# Altium schematic sheet Controller-Sheet.SchDoc
size A; DocumentNumber: 3; SheetNumber: 3; SheetTotal: 5
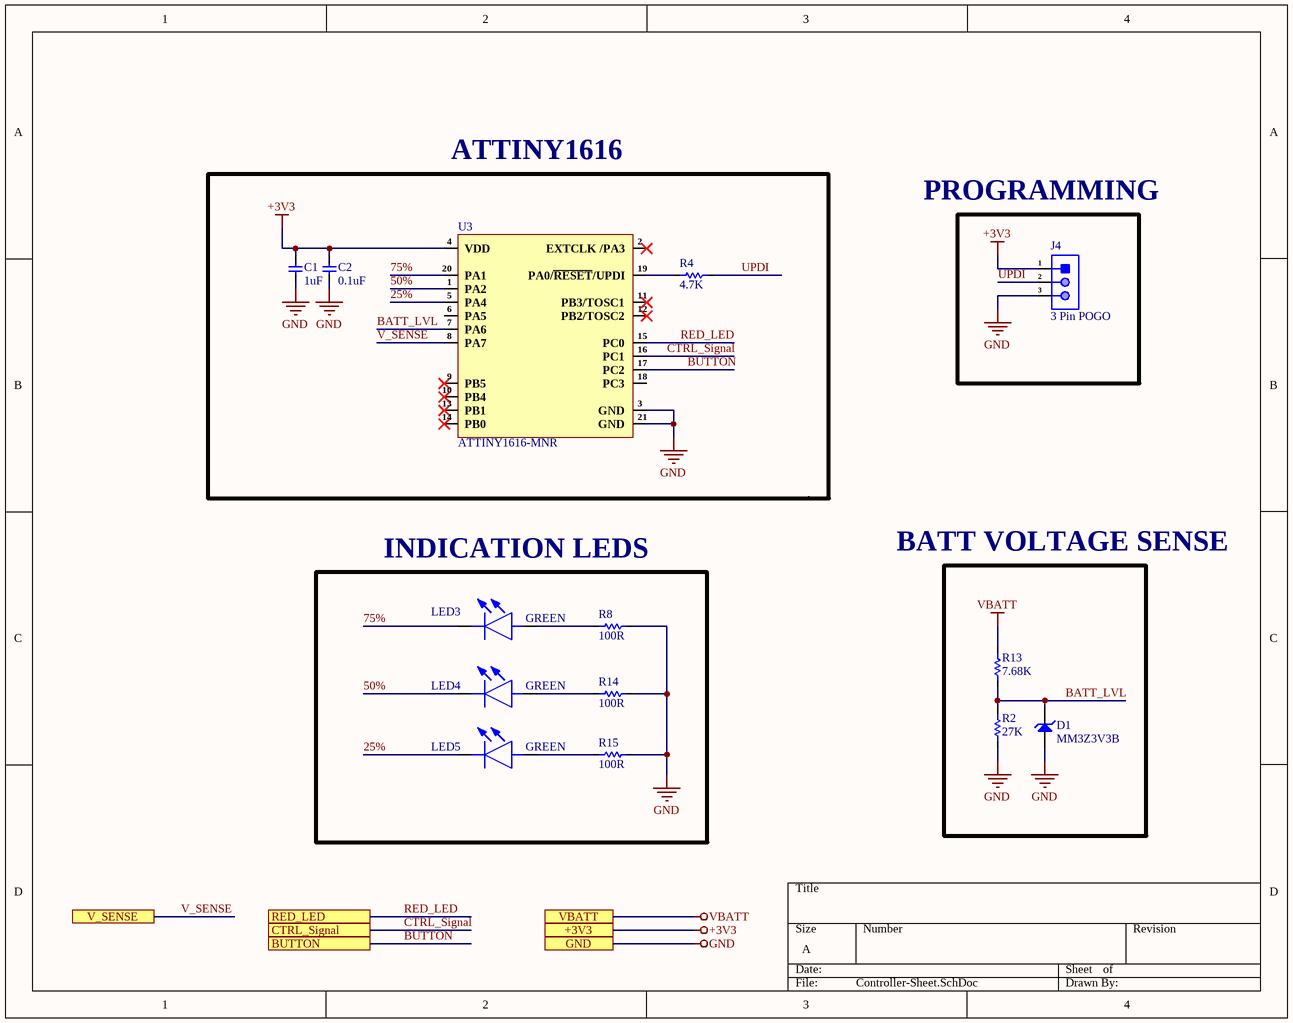
[diagram p0: Controller-Sheet.SchDoc]

## Parts
C1  1uF  [Cap-0402]
C2  0.1uF  [Cap-0402]
D1  MM3Z3V3B  [SOD323F]
J4  3 Pin POGO  [3 Pin POGO]
LED3  GREEN  [150060GS75000]
LED4  GREEN  [150060GS75000]
LED5  GREEN  [150060GS75000]
R2  27K  [Res-0402]
R4  4.7K  [Res-0402]
R8  100R  [Res-0402]
R13  7.68K  [Res-0402]
R14  100R  [Res-0402]
R15  100R  [Res-0402]
U3  ATTINY1616-MNR  [20-VQFN (3x3)]

## Blocks framed on the sheet
INDICATION LEDS: LED3-LED5 R8 R14 R15

## Ports
+3V3 (see Top-Sheet[3A], Connector-Sheet[2D], LED-Driver-Sheet[2D], Power-Sheet[2D]), BUTTON (see Top-Sheet[3B], LED-Driver-Sheet[1D]), CTRL_Signal (see Top-Sheet[3B], LED-Driver-Sheet[1D]), GND (see Top-Sheet[3A], Connector-Sheet[2D], LED-Driver-Sheet[2D], Power-Sheet[2D]), RED_LED (see Top-Sheet[3B], LED-Driver-Sheet[1D]), V_SENSE (see Top-Sheet[3B], Power-Sheet[1D]), VBATT (see Top-Sheet[3A], Connector-Sheet[2D], LED-Driver-Sheet[2D], Power-Sheet[2D])

## Nets
+3V3: C1.2 C2.2 J4.1 U3.4(VDD) ; port +3V3
GND: C1.1 C2.1 D1.1(A) J4.3 R2.1 R8.2 R14.2 R15.2 U3.3(GND) U3.21(GND) ; port GND
VBATT: R13.2 ; port VBATT
25%: LED5.1 U3.5(PA4)
50%: LED4.1 U3.1(PA2)
75%: LED3.1 U3.20(PA1)
BATT_LVL: D1.2(K) R2.2 R13.1 U3.7(PA6)
BUTTON: U3.17(PC2) ; port BUTTON
CTRL_Signal: U3.16(PC1) ; port CTRL_Signal
RED_LED: U3.15(PC0) ; port RED_LED
UPDI: J4.2 R4.2
V_SENSE: U3.8(PA7) ; port V_SENSE
NetLED3_2: LED3.2 R8.1
NetLED4_2: LED4.2 R14.1
NetLED5_2: LED5.2 R15.1
NetR4_1: R4.1 U3.19(PA0/~{RESET}/UPDI)

Not connected (* = marked no-connect by the designer): U3 2(EXTCLK_/PA3)* 6(PA5) 9(PB5)* 10(PB4)* 11(PB3/TOSC1)* 12(PB2/TOSC2)* 13(PB1)* 14(PB0)* 18(PC3)

## Notes on the sheet
- ATTINY1616
- PROGRAMMING
- BATT VOLTAGE SENSE

## Library data of the parts
C1 = GRM033R60J105MEA2D: 1 µF ±20% 6.3V Ceramic Capacitor X5R 0201 (0603 Metric); Manufacturer: Murata Electronics; Manufacturer Part Number: GRM033R60J105MEA2D; Digikey Part Number: 490-7229-6-ND; Item Type: Capacitor; Package: 0201; ComponentLink1Description: Digikey Link; ComponentLink1URL: https://www.digikey.com/en/products/detail/murata-electronics/GRM033R60J105MEA2D/4213369
C2 = GRM155R71C104KA88J: 0.1 µF ±10% 16V Ceramic Capacitor X7R 0402 (1005 Metric); Manufacturer: Murata Electronics; Manufacturer Part Number: GRM155R71C104KA88J; Digikey Part Number: 490-6328-6-ND; Item Type: Capacitor; Package: 0402; ComponentLink1Description: Digikey Link; ComponentLink1URL: https://www.digikey.com/en/products/detail/murata-electronics/GRM155R71C104KA88J/2610892
D1 = MM3Z3V3B: DIODE ZENER 3.3V 200MW SOD323F; Manufacturer: ON Semiconductor / Fairchild; Forward Voltage: 1V; Tolerance: 2%; Impedance: 89R; Max Reverse Leakage Current: 4.5uA; Test Current: 5mA; Element Configuration: Single; Supplier 1: Digi-Key; Manufacturer Part Number: MM3Z3V3B; Stock 1: 473644; Pricing 1: 1=0.22, 10=0.18, 100=0.0956, 500=0.06288, 1000=0.04276 (USD); Mount: Surface Mount; Number of Pins: 2; Weight: 0.0276g; Min Operating Temperature: -65°C; Max Operating Temperature: 150°C; Packaging: Tape and Reel; Package Quantity: 1; Max Power Dissipation: 200mW; Zener Voltage: 3.3V; Voltage Tolerance: 2%; Power Dissipation: 200mW; Working Voltage: 3.3V; Peak Reverse Current: 4.5uA; Length: 1.3mm; Height: 1mm; Width: 1.7mm; Radiation Hardening: No; REACH SVHC: No SVHC; Lead Free: Lead Free; ComponentLink1URL: http://www.onsemi.com/pub/Collateral/MM3Z9V1B-D.pdf?src-supplier=Digi-Key; ComponentLink1Description: http://www.onsemi.com/pub/Collateral/MM3Z9V1B-D.pdf?src-supplier=Digi-Key; ComponentLink2URL: http://www.mouser.com/ds/2/149/MM3Z3V3B-187166.pdf?src-supplier=Mouser; ComponentLink2Description: http://www.mouser.com/ds/2/149/MM3Z3V3B-187166.pdf?src-supplier=Mouser; ComponentLink3URL: https://www.fairchildsemi.com/datasheets/MM/MM3Z9V1B.pdf?src-supplier=Avnet; ComponentLink3Description: https://www.fairchildsemi.com/datasheets/MM/MM3Z9V1B.pdf?src-supplier=Avnet; ComponentLink4URL: http://www.farnell.com/datasheets/1706525.pdf?src-supplier=Element14; ComponentLink4Description: http://www.farnell.com/datasheets/1706525.pdf?src-supplier=Element14; Supplier Part Number 1: MM3Z3V3BCT-ND; Digikey Part Number: MM3Z3V3BDKR-ND; Item Type: Diode; ComponentLink5Description: Digikey Link; ComponentLink5URL: https://www.digikey.com/en/products/detail/onsemi/MM3Z3V3B/1626765?s=N4IgTCBcDaILJwMwC1EDVECEQF0C%2BQA
J4 = 68000-103HLF: CONN HEADER VERT 3POS 2.54MM; Item Type: Male Header; Number of Positions: 3; Current Rating: 3A; Insulation Resistance: 5GR; Voltage Rating: 1.5kV; Contact Post Length: 2.41mm; LCSC Part Number: C168677; ComponentLink1Description: LCSC; Supplier: Avnet; Supplier Part Number: 88K1775; RoHS: No; Category: Headers and Wire Housings; Stock: 2805; Pricing: 1=0.395, 10=0.31, 25=0.29, 50=0.27, 100=0.25 (USD); Contact Plating: Gold,GXT; Contact Material: Bronze; Housing Material: Thermoplastic; Housing Color: Black; Min Operating Temperature: -65°C; Max Operating Temperature: 125°C; Number of Rows: 1; Termination: Through Hole; Packaging: Bulk; Number of Contacts: 3; Contact Gender: Male; Orientation: Straight; Max Voltage Rating (AC): 1.5kV; Package Quantity: 100; Series: 68000; Length: 7.62mm; Pitch: 2.54mm; Contact Mating Length: 5.84mm; Depth: 2.41mm; Radiation Hardening: No; Flammability Rating: UL94 V-0; Reach SVHC Compliant: No; ComponentLink2URL: https://datasheet.ciiva.com/46392/1914865-46392021.pdf?src-supplier=Element14; ComponentLink2Description: https://datasheet.ciiva.com/46392/1914865-46392021.pdf?src-supplier=Element14; Digikey Part Number: 609-3461-ND; ComponentLink3Description: Digikey Link; ComponentLink3URL: https://www.digikey.com/en/products/detail/amphenol-cs-fci/68000-103HLF/2023309?s=N4IgTCBcDaIGwA4AMKC0BGJBmAEgGQDEQBdAXyA; Manufacturer Part Number: 68000-103HLF
LED3-LED5 = 150060GS75000: Green 520nm LED Indication - Discrete 3.2V 0603 (1608 Metric); Manufacturer: Würth Elektronik; Manufacturer Part Number: 150060GS75000; Supplier Part Number: 732-4971-6-ND; Item Type: LED; ComponentLink1Description: Digikey Link; ComponentLink1URL: https://www.digikey.com/en/products/detail/w%C3%BCrth-elektronik/150060GS75000/4489898; Package: 0603; Digikey Part Number: 732-4971-6-ND
R2 = RC0402FR-0727KL: 27 kOhms ±1% 0.063W, 1/16W Chip Resistor 0402 (1005 Metric) Moisture Resistant Thick Film; Manufacturer: YAGEO; Manufacturer Part Number: RC0402FR-0727KL; ComponentLink1Description: New link; ComponentLink1URL: *; Digikey Part Number: 311-27.0KLRDKR-ND; Item Type: Resistor; Package: 0402
R4 = RC0402FR-074K7L: 4.7 kOhms ±1% 0.063W, 1/16W Chip Resistor 0402 (1005 Metric) Moisture Resistant Thick Film; Manufacturer: YAGEO; Manufacturer Part Number: RC0402FR-074K7L; Digikey Part Number: 311-4.7KLRDKR-ND; Item Type: Resistor; Package: 0402; ComponentLink1Description: Digikey Link; ComponentLink1URL: https://www.digikey.com/en/products/detail/yageo/RC0402FR-074K7L/2827563
R8 R14 R15 = RC0402FR-07100RL: 100 Ohms ±1% 0.063W, 1/16W Chip Resistor 0402 (1005 Metric) Moisture Resistant Thick Film; Manufacturer: YAGEO; Manufacturer Part Number: RC0402FR-07100RL; Digikey Part Number: 311-100LRDKR-ND; Item Type: Resistor; Package: 0402; ComponentLink1Description: Digikey Link; ComponentLink1URL: https://www.digikey.com/en/products/detail/yageo/RC0402FR-07100RL/726527
R13 = AC0402FR-077K68L: 7.68 kOhms ±1% 0.063W, 1/16W Chip Resistor 0402 (1005 Metric) Automotive AEC-Q200, Moisture Resistant Thick Film; Manufacturer: YAGEO; Manufacturer Part Number: AC0402FR-077K68L; Digikey Part Number: YAG5688DKR-ND; Item Type: Resistor; Package: 0402; ComponentLink1Description: New link; ComponentLink1URL: *
U3 = ATTINY1616-MNR: AVR tinyAVR™ 1, Functional Safety (FuSa) Microcontroller IC 8-Bit 20MHz 16KB (16K x 8) FLASH 20-VQFN (3x3); Manufacturer: Microchip Tech; Manufacturer Part Number: ATTINY1616-MNR; Package: QFN-20-EP(3x3); Digikey Part Number: ATTINY1616-MNRDKR-ND; Item Type: IC; ComponentLink1URL: https://www.digikey.com/en/products/detail/microchip-technology/ATTINY1616-MNR/7354618?s=N4IgTCBcDaIIIBUEEkByBNAjANhwWgFlUAlEAXQF8g; ComponentLink1Description: Digikey Link